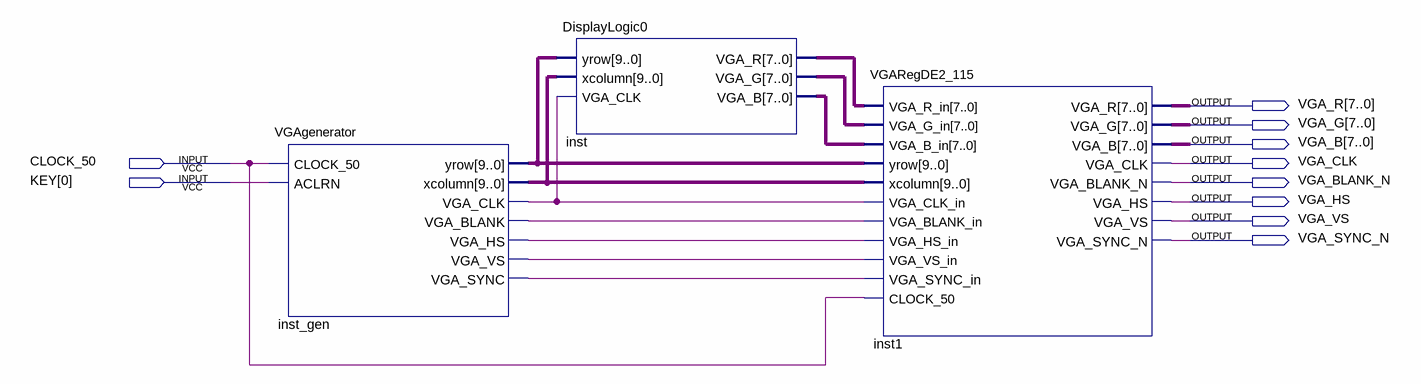
[diagram p0: schematic sheet]
// Quartus schematic Demo0.bdf as structural Verilog: 3 symbols, 10 pins
module Demo0 (
  input  CLOCK_50,
  input  [0:0] KEY,
  output [7:0] VGA_R,
  output [7:0] VGA_G,
  output [7:0] VGA_B,
  output VGA_CLK,
  output VGA_BLANK_N,
  output VGA_HS,
  output VGA_VS,
  output VGA_SYNC_N
);

  wire inst_gen_vga_blank, inst_gen_vga_clk, inst_gen_vga_hs, inst_gen_vga_sync, inst_gen_vga_vs;
  wire [7:0] inst_vga_b, inst_vga_g, inst_vga_r;
  wire [9:0] inst_gen_xcolumn, inst_gen_yrow;

  VGAgenerator inst_gen (
    .CLOCK_50(CLOCK_50), .ACLRN(KEY[0]), .yrow(inst_gen_yrow), .xcolumn(inst_gen_xcolumn),
    .VGA_CLK(inst_gen_vga_clk), .VGA_BLANK(inst_gen_vga_blank), .VGA_HS(inst_gen_vga_hs),
    .VGA_VS(inst_gen_vga_vs), .VGA_SYNC(inst_gen_vga_sync));
  DisplayLogic0 inst (
    .yrow(inst_gen_yrow), .xcolumn(inst_gen_xcolumn), .VGA_CLK(inst_gen_vga_clk), .VGA_R(inst_vga_r),
    .VGA_G(inst_vga_g), .VGA_B(inst_vga_b));
  VGARegDE2_115 inst1 (
    .VGA_R_in(inst_vga_r), .VGA_G_in(inst_vga_g), .VGA_B_in(inst_vga_b), .yrow(inst_gen_yrow),
    .xcolumn(inst_gen_xcolumn), .VGA_CLK_in(inst_gen_vga_clk), .VGA_BLANK_in(inst_gen_vga_blank),
    .VGA_HS_in(inst_gen_vga_hs), .VGA_VS_in(inst_gen_vga_vs), .VGA_SYNC_in(inst_gen_vga_sync),
    .CLOCK_50(CLOCK_50), .VGA_R(VGA_R), .VGA_G(VGA_G), .VGA_B(VGA_B), .VGA_CLK(VGA_CLK),
    .VGA_BLANK_N(VGA_BLANK_N), .VGA_HS(VGA_HS), .VGA_VS(VGA_VS), .VGA_SYNC_N(VGA_SYNC_N));
endmodule
